# EAGLE schematic navigator (EAGLE 8.2.0)
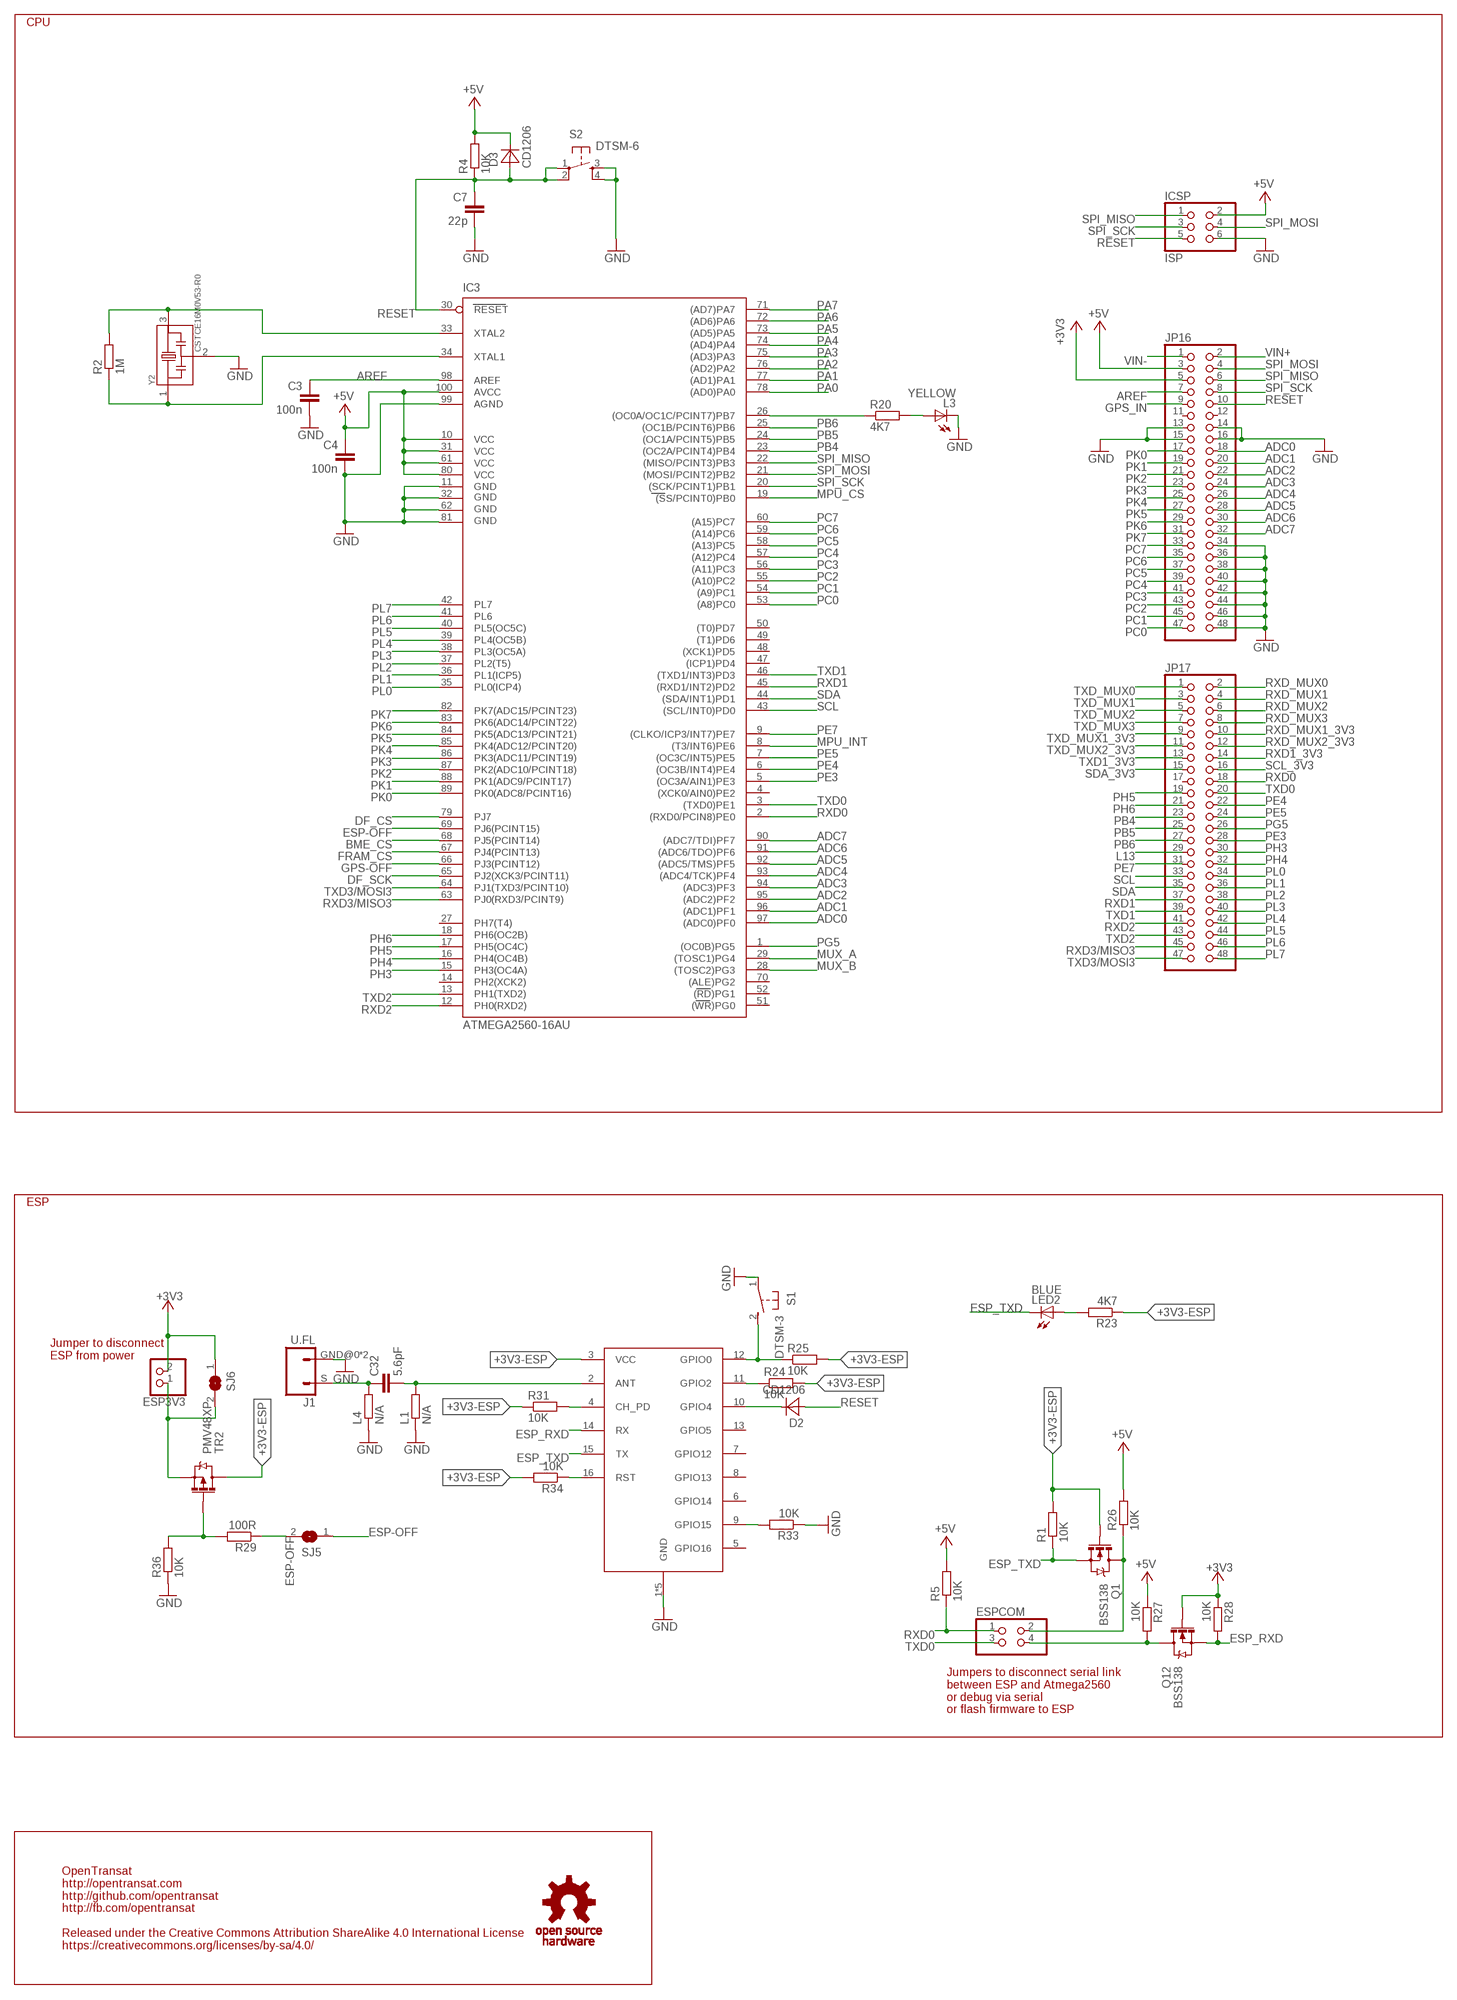
[diagram p0: schematic, sheet 1, part 1 of 2]
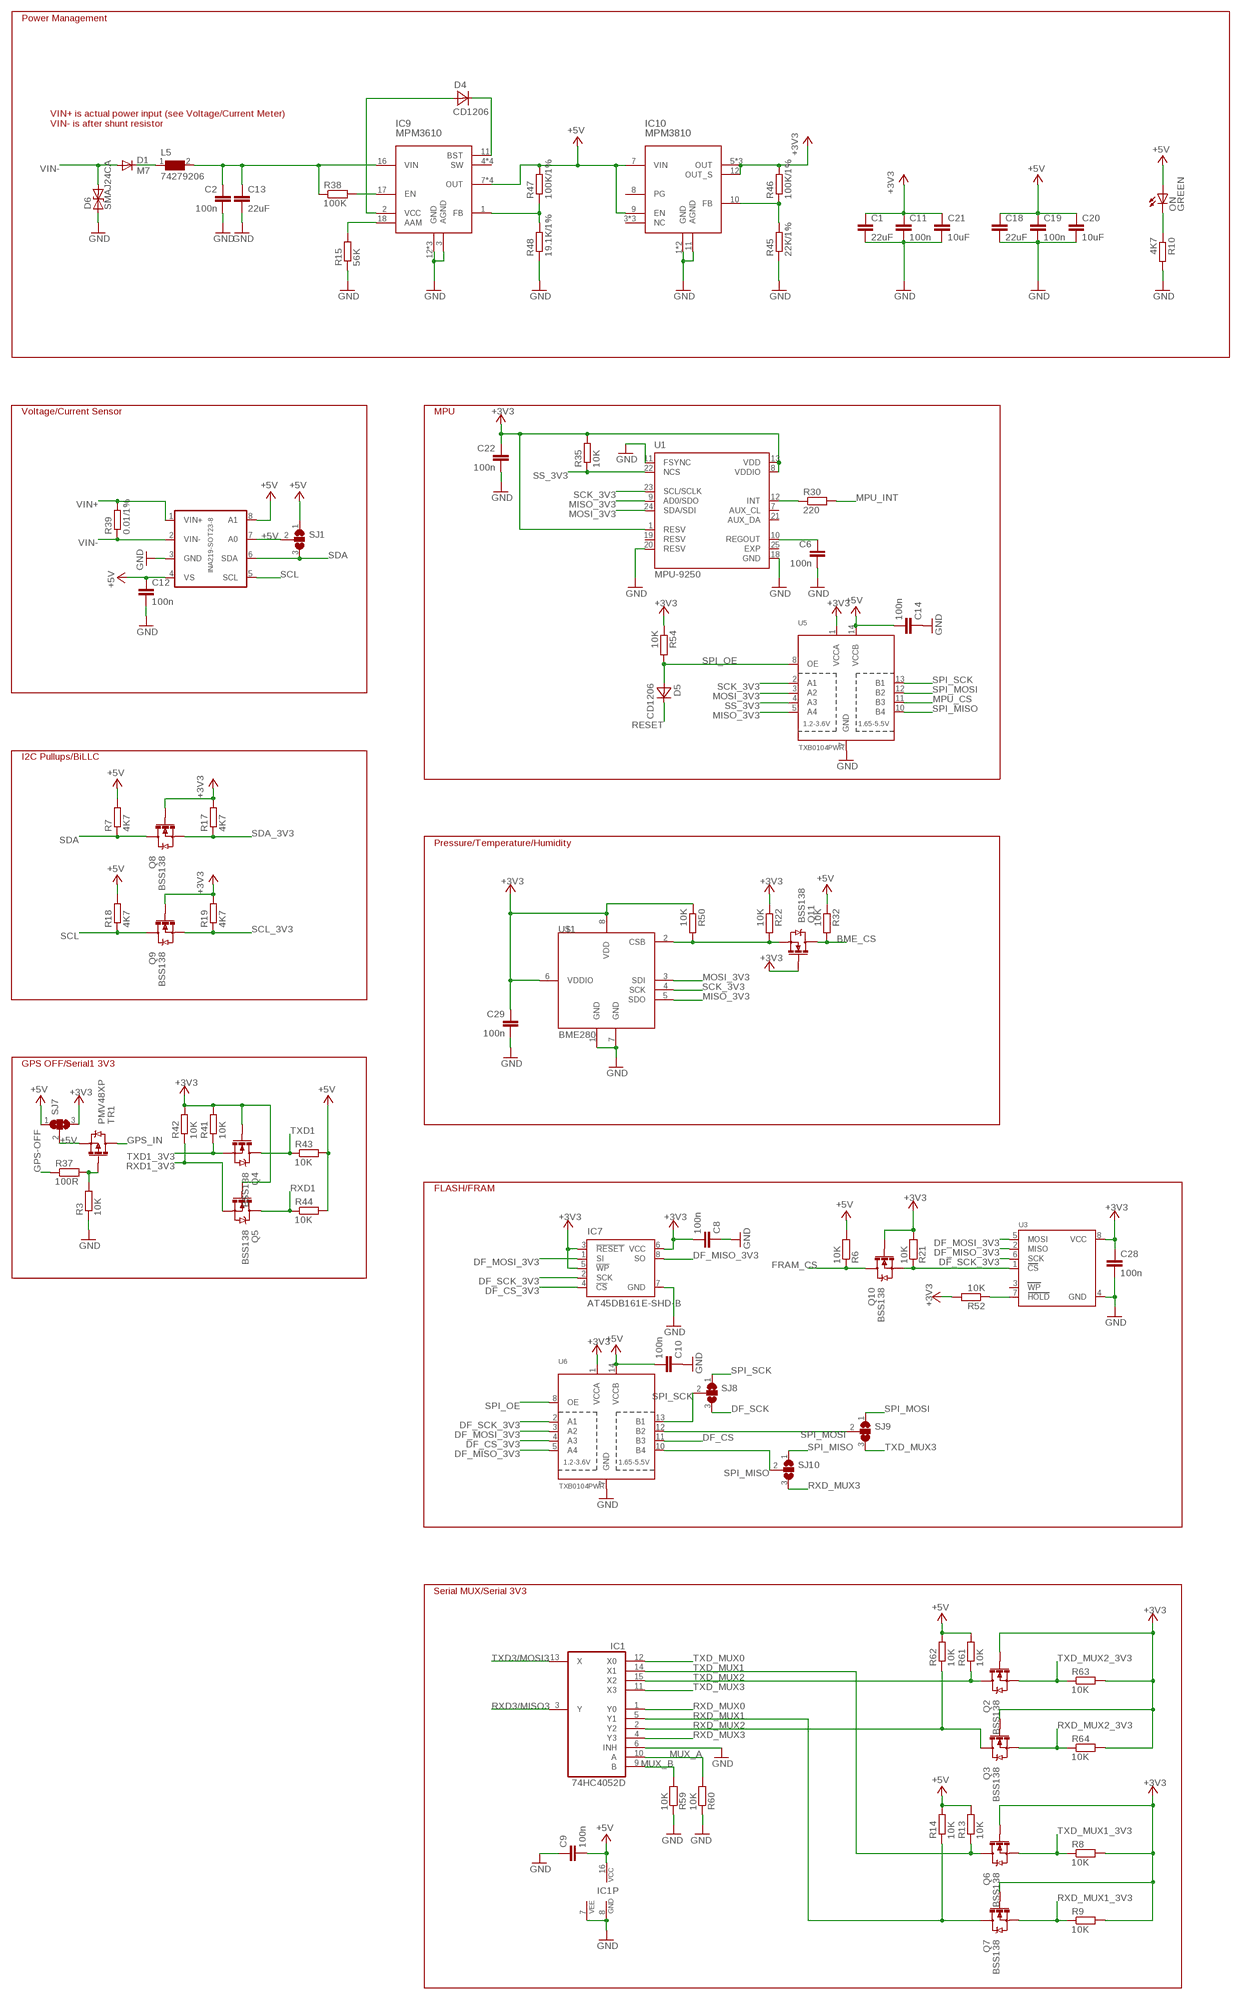
[diagram p1: schematic, sheet 1, part 2 of 2]

## Parts
C1  22uF  C-EUC1210  [C1210]
C2  100n  C-EUC0603  [C0603]
C3  100n  C-EUC0603  [C0603]
C4  100n  C-EUC0603  [C0603]
C6  100n  C-EUC0603  [C0603]
C7  22p  C-EUC0603  [C0603]
C8  100n  C-EUC0603  [C0603]
C9  100n  C-EUC0603  [C0603]
C10  100n  C-EUC0603  [C0603]
C11  100n  C-EUC0603  [C0603]
C12  100n  C-EUC0603  [C0603]
C13  22uF  C-EUC1210  [C1210]
C14  100n  C-EUC0603  [C0603]
C18  22uF  C-EUC1210  [C1210]
C19  100n  C-EUC0603  [C0603]
C20  10uF  C-EUC1206  [C1206]
C21  10uF  C-EUC1206  [C1206]
C22  100n  C-EUC0603  [C0603]
C28  100n  C-EUC0603  [C0603]
C29  100n  C-EUC0603  [C0603]
C32  5.6pF  C-EUC0603  [C0603]
D1  M7  DIODE-DO-214AC  [DO-214AC]
D2  CD1206  [R1206]
D3  CD1206  [R1206]
D4  CD1206  [R1206]
D5  CD1206  [R1206]
D6  SMAJ24CA  [DO214AC]
ESP3V3  PINHD-1X2  [1X02]
ESPCOM  PINHD-2X2  [2X02]
IC1  74HC4052D  4052D  [SO16]
IC3  ATMEGA2560-16AU  [TQFP100]
IC7  AT45DB161E-SHD-B  AT45DB161D-SU  [8S2]
IC9  MPM3610  [MPM_QFN20]
IC10  MPM3810  [MPM_QFN12]
ICSP  ISP  PINHD-2X3  [2X03]
J1  U.FL  CON-HIROSE-COAXIAL-U.FL  [CON-U.FL]
JP16  PINHD-2X24  [2X24]
JP17  PINHD-2X24  [2X24]
L1  N/A  R-EU_R0402  [R0402]
L3  YELLOW  LEDCHIPLED_0805  [CHIPLED_0805]
L4  N/A  R-EU_R0402  [R0402]
L5  74279206  WE-CBF_0805  [0805]
LED2  BLUE  LEDCHIPLED_0805  [CHIPLED_0805]
ON  GREEN  LEDCHIPLED_0805  [CHIPLED_0805]
Q1  BSS138  MOSFET-NCHANNEL_SOT23-3  [SOT23-3]
Q2  BSS138  MOSFET-NCHANNEL_SOT23-3  [SOT23-3]
Q3  BSS138  MOSFET-NCHANNEL_SOT23-3  [SOT23-3]
Q4  BSS138  MOSFET-NCHANNEL_SOT23-3  [SOT23-3]
Q5  BSS138  MOSFET-NCHANNEL_SOT23-3  [SOT23-3]
Q6  BSS138  MOSFET-NCHANNEL_SOT23-3  [SOT23-3]
Q7  BSS138  MOSFET-NCHANNEL_SOT23-3  [SOT23-3]
Q8  BSS138  MOSFET-NCHANNEL_SOT23-3  [SOT23-3]
Q9  BSS138  MOSFET-NCHANNEL_SOT23-3  [SOT23-3]
Q10  BSS138  MOSFET-NCHANNEL_SOT23-3  [SOT23-3]
Q11  BSS138  MOSFET-NCHANNEL_SOT23-3  [SOT23-3]
Q12  BSS138  MOSFET-NCHANNEL_SOT23-3  [SOT23-3]
R1  10K  R-EU_R0603  [R0603]
R2  1M  R-EU_R0603  [R0603]
R3  10K  R-EU_R0603  [R0603]
R4  10K  R-EU_R0603  [R0603]
R5  10K  R-EU_R0603  [R0603]
R6  10K  R-EU_R0603  [R0603]
R7  4K7  R-EU_R0603  [R0603]
R8  10K  R-EU_R0603  [R0603]
R9  10K  R-EU_R0603  [R0603]
R10  4K7  R-EU_R0603  [R0603]
R13  10K  R-EU_R0603  [R0603]
R14  10K  R-EU_R0603  [R0603]
R15  56K  R-EU_R0603  [R0603]
R17  4K7  R-EU_R0603  [R0603]
R18  4K7  R-EU_R0603  [R0603]
R19  4K7  R-EU_R0603  [R0603]
R20  4K7  R-EU_R0603  [R0603]
R21  10K  R-EU_R0603  [R0603]
R22  10K  R-EU_R0603  [R0603]
R23  4K7  R-EU_R0603  [R0603]
R24  10K  R-EU_R0603  [R0603]
R25  10K  R-EU_R0603  [R0603]
R26  10K  R-EU_R0603  [R0603]
R27  10K  R-EU_R0603  [R0603]
R28  10K  R-EU_R0603  [R0603]
R29  100R  R-EU_R0603  [R0603]
R30  220  R-EU_R0603  [R0603]
R31  10K  R-EU_R0603  [R0603]
R32  10K  R-EU_R0603  [R0603]
R33  10K  R-EU_R0603  [R0603]
R34  10K  R-EU_R0603  [R0603]
R35  10K  R-EU_R0603  [R0603]
R36  10K  R-EU_R0603  [R0603]
R37  100R  R-EU_R0603  [R0603]
R38  100K  R-EU_R0603  [R0603]
R39  0.01/1%  R-EU_R2512  [R2512]
R41  10K  R-EU_R0603  [R0603]
R42  10K  R-EU_R0603  [R0603]
R43  10K  R-EU_R0603  [R0603]
R44  10K  R-EU_R0603  [R0603]
R45  22K/1%  R-EU_R0603  [R0603]
R46  100K/1%  R-EU_R0603  [R0603]
R47  100K/1%  R-EU_R0603  [R0603]
R48  19.1K/1%  R-EU_R0603  [R0603]
R50  10K  R-EU_R0603  [R0603]
R52  10K  R-EU_R0603  [R0603]
R54  10K  R-EU_R0603  [R0603]
R59  10K  R-EU_R0603  [R0603]
R60  10K  R-EU_R0603  [R0603]
R61  10K  R-EU_R0603  [R0603]
R62  10K  R-EU_R0603  [R0603]
R63  10K  R-EU_R0603  [R0603]
R64  10K  R-EU_R0603  [R0603]
S1  DTSM-3  [DTSM-3]
S2  DTSM-6  [DTSM-6]
SJ1  SJ2W  [SJ_2]
SJ5  SJ  [SJ]
SJ6  SJ  [SJ]
SJ7  SJ2W  [SJ_2]
SJ8  SJ2W  [SJ_2]
SJ9  SJ2W  [SJ_2]
SJ10  SJ2W  [SJ_2]
TR1  PMV48XP  MOSFET-PCHANNEL_SOT23-3  [SOT23-3]
TR2  PMV48XP  MOSFET-PCHANNEL_SOT23-3  [SOT23-3]
U1  MPU-9250  [QFN40P300X300X105-25N]
U3  FRAM_SOIC8_200MIL_SPI  [SOIC8_200MIL]
U5  TXB0104PWR  [TSSOP14]
U6  TXB0104PWR  [TSSOP14]
U$1  BME280  BME280BME280-LGA  [BME280]
U$2  ESP-06  [ESP-06]
U$3  INA219-SOT23-8  [SOT23-8]
U$4  OSHW  [OSHWM]
Y2  CSTCE16M0V53-R0  [OSC_CSTCE16M0V53-R0]

## Nets
+3V3 [power 3.3V]: C1.1 C8.2 C11.1 C21.1 C22.1 C28.1 C29.1 ESP3V3.2 IC7.3(!RESET) IC7.5(!WP) IC7.6(VCC) IC10.5(OUT) IC10.6(OUT) IC10.12(OUT_S) IC10.14(OUT) JP16.5 Q2.1(G) Q3.1(G) Q4.1(G) Q5.1(G) Q6.1(G) Q7.1(G) Q8.1(G) Q9.1(G) Q10.1(G) Q11.1(G) Q12.1(G) R8.2 R9.2 R17.2 R19.2 R21.2 R22.1 R28.1 R35.2 R41.2 R42.2 R46.2 R50.1 R52.2 R54.1 R63.2 R64.2 SJ6.1 SJ7.3 U1.1(RESV) U1.8(VDDIO) U1.13(VDD) U3.8(VCC) U5.1(VCCA) U6.1(VCCA) U$1.6(VDDIO) U$1.8(VDD)
+3V3-ESP: Q1.1(G) R1.2 R23.1 R24.2 R25.2 R31.1 R34.2 TR2.3(D) U$2.3(VCC)
+5V [power 5V]: C4.1 C9.2 C10.2 C12.1 C14.2 C18.1 C19.1 C20.1 D3.2(C) IC1.16(VCC) IC3.10(VCC) IC3.31(VCC1) IC3.61(VCC2) IC3.80(VCC3) IC3.100(AVCC) IC9.7(OUT) IC9.8(OUT) IC9.9(OUT) IC9.20(OUT) IC10.7(VIN) IC10.9(EN) ICSP.2 JP16.3 ON.A R4.2 R5.2 R6.2 R7.2 R13.2 R14.2 R18.2 R26.2 R27.1 R32.1 R43.2 R44.2 R47.2 R61.2 R62.2 SJ1.1 SJ1.2 SJ7.1 SJ7.2 TR1.2(S) U5.14(VCCB) U6.14(VCCB) U$3.4(VS) U$3.7(A0) U$3.8(A1)
ADC0: IC3.97((ADC0)PF0) JP16.18
ADC1: IC3.96((ADC1)PF1) JP16.20
ADC2: IC3.95((ADC2)PF2) JP16.22
ADC3: IC3.94((ADC3)PF3) JP16.24
ADC4: IC3.93((ADC4/TCK)PF4) JP16.26
ADC5: IC3.92((ADC5/TMS)PF5) JP16.28
ADC6: IC3.91((ADC6/TDO)PF6) JP16.30
ADC7: IC3.90((ADC7/TDI)PF7) JP16.32
AREF: C3.1 IC3.98(AREF) JP16.7
BME_CS: IC3.68(PJ5(PCINT14)) Q11.3(D) R32.2
DF_CS: IC3.79(PJ7) U6.11(B3)
DF_CS_3V3: IC7.4(!CS) U6.4(A3)
DF_MISO_3V3: IC7.8(SO) U3.2(MISO) U6.5(A4)
DF_MOSI_3V3: IC7.1(SI) U3.5(MOSI) U6.3(A2)
DF_SCK: IC3.65(PJ2(XCK3/PCINT11)) SJ8.3
DF_SCK_3V3: IC7.2(SCK) U3.6(SCK) U6.2(A1)
ESP-OFF: IC3.69(PJ6(PCINT15)) R29.1 SJ5.1 SJ5.2
ESP_RXD: Q12.2(S) R28.2 U$2.14(RX)
ESP_TXD: LED2.C Q1.2(S) R1.1 U$2.15(TX)
FRAM_CS: IC3.67(PJ4(PCINT13)) Q10.3(D) R6.1
GND [GND]: C1.2 C2.2 C3.2 C4.2 C6.2 C7.2 C8.1 C9.1 C10.1 C11.2 C12.2 C13.2 C14.1 C18.2 C19.2 C20.2 C21.2 C22.2 C28.2 C29.2 D6.A IC1.6(INH) IC1.7(VEE) IC1.8(GND) IC3.11(GND) IC3.32(GND1) IC3.62(GND2) IC3.81(GND3) IC3.99(AGND) IC7.7(GND) IC9.3(AGND) IC9.12(GND) IC9.13(GND) IC9.14(GND) IC10.1(GND) IC10.2(GND) IC10.11(AGND) ICSP.6 J1.GND@0 J1.GND@1 JP16.13 JP16.14 JP16.15 JP16.16 JP16.34 JP16.36 JP16.38 JP16.40 JP16.42 JP16.44 JP16.46 JP16.48 L1.1 L3.C L4.1 R3.1 R10.2 R15.1 R33.1 R36.1 R45.1 R48.1 R59.1 R60.1 S1.1 S2.3 S2.4 U1.11(FSYNC) U1.18(GND) U1.20(RESV) U3.4(GND) U5.7(GND) U6.7(GND) U$1.1(GND) U$1.7(GND) U$2.1(GND) U$2.17(GND) U$2.18(GND) U$2.19(GND) U$2.20(GND) U$3.3(GND) Y2.2
GPS-OFF: IC3.66(PJ3(PCINT12)) R37.1
GPS_IN: JP16.9 TR1.3(D)
L13: IC3.26((OC0A/OC1C/PCINT7)PB7) JP17.29 R20.1
MISO_3V3: U1.9(AD0/SDO) U5.5(A4) U$1.5(SDO)
MOSI_3V3: U1.24(SDA/SDI) U5.3(A2) U$1.3(SDI)
MPU_CS: IC3.19((SS/PCINT0)PB0) U5.11(B3)
MPU_INT: IC3.8((T3/INT6)PE6) R30.2
MUX_A: IC1.10(A) IC3.29((TOSC1)PG4) R60.2
MUX_B: IC1.9(B) IC3.28((TOSC2)PG3) R59.2
N$1: ESP3V3.1 SJ6.2 TR2.2(S)
N$2: R52.1 U3.7(HOLD)
N$3: ON.C R10.1
N$4: L3.A R20.2
N$5 [power 5V]: D4.1(A) IC9.2(VCC)
N$6: D4.2(C) IC9.11(BST)
N$7: LED2.A R23.2
N$8: R31.2 U$2.4(CH_PD)
N$9: R24.1 U$2.11(GPIO2)
N$10: D2.2(C) U$2.10(GPIO4)
N$11: R33.2 U$2.9(GPIO15)
N$12: C32.1 J1.S L4.2
N$13: R25.1 S1.2 U$2.12(GPIO0)
N$14: R34.1 U$2.16(RST)
N$15: C32.2 L1.2 U$2.2(ANT)
N$16: Q10.2(S) R21.1 U3.1(CS)
N$19: IC10.10(FB) R45.2 R46.1
N$20: ESPCOM.2 Q1.3(D) R26.1
N$21: ESPCOM.4 Q12.3(D) R27.2
N$24: R3.2 R37.2 TR1.1(G)
N$25: R29.2 R36.2 TR2.1(G)
N$26: IC9.1(FB) R47.1 R48.2
N$28: IC9.17(EN) R38.2
N$29: IC9.18(AAM) R15.2
N$31: Q11.2(S) R22.2 R50.2 U$1.2(CSB)
N$35: R30.1 U1.12(INT)
PA0: IC3.78((AD0)PA0)
PA1: IC3.77((AD1)PA1)
PA2: IC3.76((AD2)PA2)
PA3: IC3.75((AD3)PA3)
PA4: IC3.74((AD4)PA4)
PA5: IC3.73((AD5)PA5)
PA6: IC3.72((AD6)PA6)
PA7: IC3.71((AD7)PA7)
PB4: IC3.23((OC2A/PCINT4)PB4) JP17.23
PB5: IC3.24((OC1A/PCINT5)PB5) JP17.25
PB6: IC3.25((OC1B/PCINT6)PB6) JP17.27
PC0: IC3.53((A8)PC0) JP16.47
PC1: IC3.54((A9)PC1) JP16.45
PC2: IC3.55((A10)PC2) JP16.43
PC3: IC3.56((A11)PC3) JP16.41
PC4: IC3.57((A12)PC4) JP16.39
PC5: IC3.58((A13)PC5) JP16.37
PC6: IC3.59((A14)PC6) JP16.35
PC7: IC3.60((A15)PC7) JP16.33
PE3: IC3.5((OC3A/AIN1)PE3) JP17.28
PE4: IC3.6((OC3B/INT4)PE4) JP17.22
PE5: IC3.7((OC3C/INT5)PE5) JP17.24
PE7: IC3.9((CLKO/ICP3/INT7)PE7) JP17.31
PG5: IC3.1((OC0B)PG5) JP17.26
PH3: IC3.15(PH3(OC4A)) JP17.30
PH4: IC3.16(PH4(OC4B)) JP17.32
PH5: IC3.17(PH5(OC4C)) JP17.19
PH6: IC3.18(PH6(OC2B)) JP17.21
PK0: IC3.89(PK0(ADC8/PCINT16)) JP16.17
PK1: IC3.88(PK1(ADC9/PCINT17)) JP16.19
PK2: IC3.87(PK2(ADC10/PCINT18)) JP16.21
PK3: IC3.86(PK3(ADC11/PCINT19)) JP16.23
PK4: IC3.85(PK4(ADC12/PCINT20)) JP16.25
PK5: IC3.84(PK5(ADC13/PCINT21)) JP16.27
PK6: IC3.83(PK6(ADC14/PCINT22)) JP16.29
PK7: IC3.82(PK7(ADC15/PCINT23)) JP16.31
PL0: IC3.35(PL0(ICP4)) JP17.34
PL1: IC3.36(PL1(ICP5)) JP17.36
PL2: IC3.37(PL2(T5)) JP17.38
PL3: IC3.38(PL3(OC5A)) JP17.40
PL4: IC3.39(PL4(OC5B)) JP17.42
PL5: IC3.40(PL5(OC5C)) JP17.44
PL6: IC3.41(PL6) JP17.46
PL7: IC3.42(PL7) JP17.48
PWRIN2 [power 5V]: D1.C L5.1
REGOUT: C6.1 U1.10(REGOUT)
RESET: C7.1 D2.1(A) D3.1(A) D5.2(C) IC3.30(RESET) ICSP.5 JP16.10 R4.1 S2.1 S2.2
RXD0: ESPCOM.1 IC3.2((RXD0/PCIN8)PE0) JP17.18 R5.1
RXD1: IC3.45((RXD1/INT2)PD2) JP17.37 Q5.3(D) R44.1
RXD1_3V3: JP17.14 Q5.2(S) R42.1
RXD2: IC3.12(PH0(RXD2)) JP17.41
RXD3/MISO3: IC1.3(Y) IC3.63(PJ0(RXD3/PCINT9)) JP17.45
RXD_MUX0: IC1.1(Y0) JP17.2
RXD_MUX1: IC1.5(Y1) JP17.4 Q7.3(D) R14.1
RXD_MUX1_3V3: JP17.10 Q7.2(S) R9.1
RXD_MUX2: IC1.2(Y2) JP17.6 Q3.3(D) R62.1
RXD_MUX2_3V3: JP17.12 Q3.2(S) R64.1
RXD_MUX3: IC1.4(Y3) JP17.8 SJ10.3
SCK_3V3: U1.23(SCL/SCLK) U5.2(A1) U$1.4(SCK)
SCL: IC3.43((SCL/INT0)PD0) JP17.33 Q9.3(D) R18.1 U$3.5(SCL)
SCL_3V3: JP17.16 Q9.2(S) R19.1
SDA: IC3.44((SDA/INT1)PD1) JP17.35 Q8.3(D) R7.1 SJ1.3 U$3.6(SDA)
SDA_3V3: JP17.15 Q8.2(S) R17.1
SPI_MISO: IC3.22((MISO/PCINT3)PB3) ICSP.1 JP16.6 SJ10.1 SJ10.2 U5.10(B4) U6.10(B4)
SPI_MOSI: IC3.21((MOSI/PCINT2)PB2) ICSP.4 JP16.4 SJ9.1 SJ9.2 U5.12(B2) U6.12(B2)
SPI_OE: D5.1(A) R54.2 U5.8(OE) U6.8(OE)
SPI_SCK: IC3.20((SCK/PCINT1)PB1) ICSP.3 JP16.8 SJ8.1 SJ8.2 U5.13(B1) U6.13(B1)
SS_3V3: R35.1 U1.22(NCS) U5.4(A3)
TXD0: ESPCOM.3 IC3.3((TXD0)PE1) JP17.20
TXD1: IC3.46((TXD1/INT3)PD3) JP17.39 Q4.3(D) R43.1
TXD1_3V3: JP17.13 Q4.2(S) R41.1
TXD2: IC3.13(PH1(TXD2)) JP17.43
TXD3/MOSI3: IC1.13(X) IC3.64(PJ1(TXD3/PCINT10)) JP17.47
TXD_MUX0: IC1.12(X0) JP17.1
TXD_MUX1: IC1.14(X1) JP17.3 Q6.3(D) R13.1
TXD_MUX1_3V3: JP17.9 Q6.2(S) R8.1
TXD_MUX2: IC1.15(X2) JP17.5 Q2.3(D) R61.1
TXD_MUX2_3V3: JP17.11 Q2.2(S) R63.1
TXD_MUX3: IC1.11(X3) JP17.7 SJ9.3
VIN [power 5V]: C2.1 C13.1 IC9.16(VIN) L5.2 R38.1
VIN+ [power 5V]: JP16.2 R39.2 U$3.1(VIN+)
VIN- [power 5V]: D1.A D6.C JP16.1 R39.1 U$3.2(VIN-)
XTAL1: IC3.34(XTAL1) R2.1 Y2.1
XTAL2: IC3.33(XTAL2) R2.2 Y2.3
Unconnected: IC3.4((XCK0/AIN0)PE2) IC3.14(PH2(XCK2)) IC3.27(PH7(T4)) IC3.47((ICP1)PD4) IC3.48((XCK1)PD5) IC3.49((T1)PD6) IC3.50((T0)PD7) IC3.51((WR)PG0) IC3.52((RD)PG1) IC3.70((ALE)PG2) IC9.4(SW) IC9.5(SW) IC9.6(SW) IC9.19(SW) IC10.3(NC) IC10.4(NC) IC10.8(PG) IC10.13(NC) JP16.11 JP16.12 JP17.17 U1.7(AUX_CL) U1.21(AUX_DA) U3.3(WP) U$2.5(GPIO16) U$2.6(GPIO14) U$2.7(GPIO12) U$2.8(GPIO13) U$2.13(GPIO5)

## Notes on the sheet
- CPU | Power Management
- VIN+ is actual power input (see Voltage/Current Meter)
  VIN- is after shunt resistor
- Voltage/Current Sensor | MPU
- I2C Pullups/BiLLC
- Pressure/Temperature/Humidity
- ESP
- GPS OFF/Serial1 3V3
- Jumper to disconnect
  ESP from power
- FLASH/FRAM
- Jumpers to disconnect serial link
  between ESP and Atmega2560
  or debug via serial
  or flash firmware to ESP
- OpenTransat
  http://opentransat.com
  http://github.com/opentransat
  http://fb.com/opentransat
  
  Released under the Creative Commons Attribution ShareAlike 4.0 International License
  https://creativecommons.org/licenses/by-sa/4.0/
- Serial MUX/Serial 3V3

## Power pins joined to a net without a drawn wire
EXP: U1.25(EXP)
RESV: U1.19(RESV)

## Library data of the parts
C1-C4 C6-C14 C18-C22 C28 C29 C32 = rcl:C-EU: CAPACITOR, European symbol
D1 = diode:DIODE-: DIODE
D2-D5 = diodes_smd:CD1206
D6 = smaj_10:SMAJ*CA: SMAJ Series TVS Diodes Source: http://www.littelfuse.com/~/media/electronics/datasheets/tvs_diodes/littelfuse_tvs_diode_smaj_datasheet.pdf.pdf; MF: Littelfuse; MPN: SMAJ24CA; OC_FARNELL: 1677579; OC_NEWARK: 71J1995
ESP3V3 = pinhead:PINHD-1X2: PIN HEADER
ESPCOM = pinhead:PINHD-2X2: PIN HEADER
IC1 = 40xx_spads:4052: Dual 4-channel ANALOG MULTIPLEXER
IC3 = atmel-2005:ATMEGA*: MICROCONTROLLER 64/128/256 Kbytes FLASH 4 Kbytes EEPROM 8 Kbytes SRAM 86 General Purpose I/O pins 12-channels16-bit PWM 4 x Serial USARTs 16-channels 10-bit A/D
IC7 = atmel:AT45DB161D: 16-megabit 2.5V or 2.7V DataFlash Source: http://www.atmel.com/dyn/resources/prod_documents/doc3500.pdf; MF: ATMEL; MPN: AT45DB161D-SU; OC_FARNELL: 1455040
IC9 = Buck_Converters:MPM3610; MOUSER: http://www.mouser.sk/search/ProductDetail.aspx?R=0virtualkey0virtualkeyMPM3610GQV-P
IC10 = Buck_Converters:MPM3810; MOUSER: http://www.mouser.sk/search/ProductDetail.aspx?R=0virtualkey0virtualkeyMPM3810GQB-33-P
ICSP = pinhead:PINHD-2X3: PIN HEADER
J1 = m-pad-2.1:CON-HIROSE-COAXIAL: Hirose SMT 50 ohm impedance connector W.FL ............................. 1.4mm mated height, ultra small SMT connectors .................................. DC to 3GHz U.FL .............................. 1.9mm or 2.4mm mated height, ultra small SMT connectors ................... DC to 6GHz E.FL ............................... 3.2mm mated height, ultra small SMT connectors .................................. DC to 2GHz H.FL .............................. 3.0mm mated height, ultra small SMT connectors ................................... DC to 3GHz S.FL. ............................. 6.0mm mated height, SMT connectors ................................................... DC to 2.5GHz FL ................................. 10.5mm mated height, SMT connectors .................................................. DC to 1.5GHz Please send any comments to: messi@users.sourceforge.net
JP16 JP17 = pinhead:PINHD-2X24: PIN HEADER
L1 L4 R1-R10 R13-R15 R17-R39 R41-R48 R50 R52 R54 R59-R64 = rcl:R-EU_: RESISTOR, European symbol
L3 LED2 ON = led:LED: LED OSRAM: - CHIPLED LG R971, LG N971, LY N971, LG Q971, LY Q971, LO R971, LY R971 LH N974, LH R974 LS Q976, LO Q976, LY Q976 LO Q996 - Hyper CHIPLED LW Q18S LB Q993, LB Q99A, LB R99A - SideLED LS A670, LO A670, LY A670, LG A670, LP A670 LB A673, LV A673, LT A673, LW A673 LH A674 LY A675 LS A676, LA A676, LO A676, LY A676, LW A676 LS A679, LY A679, LG A679 - Hyper Micro SIDELED® LS Y876, LA Y876, LO Y876, LY Y876 LT Y87S - SmartLED LW L88C, LW L88S LB L89C, LB L89S, LG L890 LS L89K, LO L89K, LY L89K LS L896, LA L896, LO L896, LY L896 - TOPLED LS T670, LO T670, LY T670, LG T670, LP T670 LSG T670, LSP T670, LSY T670, LOP T670, LYG T670 LG T671, LOG T671, LSG T671 LB T673, LV T673, LT T673, LW T673 LH T674 LS T676, LA T676, LO T676, LY T676, LB T676, LH T676, LSB T676, LW T676 LB T67C, LV T67C, LT T67C, LS T67K, LO T67K, LY T67K, LW E67C LS E67B, LA E67B, LO E67B, LY E67B, LB E67C, LV E67C, LT E67C LW T67C LS T679, LY T679, LG T679 LS T770, LO T770, LY T770, LG T770, LP T770 LB T773, LV T773, LT T773, LW T773 LH T774 LS E675, LA E675, LY E675, LS T675 LS T776, LA T776, LO T776, LY T776, LB T776 LHGB T686 LT T68C, LB T68C - Hyper Mini TOPLED® LB M676 - Mini TOPLED Santana® LG M470 LS M47K, LO M47K, LY M47K Source: http://www.osram.convergy.de LUXEON: - LUMILED® LXK2-PW12-R00, LXK2-PW12-S00, LXK2-PW14-U00, LXK2-PW14-V00 LXK2-PM12-R00, LXK2-PM12-S00, LXK2-PM14-U00 LXK2-PE12-Q00, LXK2-PE12-R00, LXK2-PE12-S00, LXK2-PE14-T00, LXK2-PE14-U00 LXK2-PB12-K00, LXK2-PB12-L00, LXK2-PB12-M00, LXK2-PB14-N00, LXK2-PB14-P00, LXK2-PB14-Q00 LXK2-PR12-L00, LXK2-PR12-M00, LXK2-PR14-Q00, LXK2-PR14-R00 LXK2-PD12-Q00, LXK2-PD12-R00, LXK2-PD12-S00 LXK2-PH12-R00, LXK2-PH12-S00 LXK2-PL12-P00, LXK2-PL12-Q00, LXK2-PL12-R00 Source: www.luxeon.com KINGBRIGHT: KA-3528ASYC Source: www.kingbright.com
L5 = Wurth_Elektronik_Passive_rev15b:WE-CBF: SMD EMI Suppression Ferrite Beads WE-CBF - Excellent anti-EMI properties - Low DC-restistance - Impedances till 3000 ohms - Rated current up to 6 A -- Reliable Ni-Sn electrodes -- Perfect as data lined filter and for uncoupling of distribution voltage <http://katalog.we-online.de/media/images/eisos/FeCBF_pf2.jpg> Details see: http://katalog.we-online.de/en/pbs/WE-CBF updated by Dan Xu 2014-06-19 2014 (C) Würth Elektronik
Q1-Q12 = Simplex-DiscreteSemi:MOSFET-NCHANNEL: Generic N-channel mosfet
S1 = switch-tact:DTSM-3
S2 = switch-tact:DTSM-6
SJ1 SJ7-SJ10 = jumper:SJ2W: SMD solder JUMPER
SJ5 SJ6 = jumper:SJ: SMD solder JUMPER
TR1 TR2 = Simplex-DiscreteSemi:MOSFET-PCHANNEL: Generic P-channel mosfet
U1 = MPU-9250:MPU-9250: GYRO/ACCEL/COMPASS/9-AXIS; AVAILABILITY: Good; DESCRIPTION: SMD Gyroscope/Accelerometer/Magnetometer Sensor%3B 9-AXIS; MF: InvenSense; MP: MPU-9250; PACKAGE: QFN-24 InvenSense; PRICE: 6.51 USD
U3 = FRAM:FRAM_SOIC8_200MIL_SPI: SPI FRAM - SOIC8 Package 64KBit (8Kx8) - MB85RS64VPNF-G-JNERE1 - SOIC-8 150 Mil, 3-5.5V, -40°C-85°C, 20MHz
U5 U6 = TXB0104PWR:TXB0104PWR: 4-Bit Bi-Directional Level Shifter 1.2V-3.6V (VCCA) to 1.65V-5.5V (VCCB) bi-directional level shifter with auto direction sensing. Max data rate - VCCA 1.8V: 20Mbps (50ns), VCCA 3.3V: 100Mbps (10ns) Digikey: 296-21929-1-ND (TSSOP) IC-11329; AVAILABILITY: Good; DESCRIPTION: 4-Bit Bidirectional Voltage-Level Translator with Auto Direction Sensing and %2B/-15 kV ESD Protect 14-TSSOP -40 to 85; MF: Texas Instruments; MP: TXB0104PWR; PACKAGE: TSSOP-14 Texas Instruments; PRICE: 24.06 USD
U$1 = BME280:BME280; AVAILABILITY: Good; DESCRIPTION: Integrated pressure%2C humidity and temperature sensor%3B 8-pin 2.5x2.5x0.93mm LGA; MF: Bosch; MP: BME280; PACKAGE: LGA-8 Bosch; PRICE: 5.08 USD
U$2 = ESP:ESP-06: ESP8266 Wifi chip
U$3 = INA219:INA219-SOT23-8: INA219 Bi-Directional CURRENT/POWER MONITOR with I2C™ Interface http://www.ti.com/lit/ds/symlink/ina219.pdf
U$4 = oshw:OSHW
Y2 = CSTCE16M0V53-R0:CSTCE16M0V53-R0: 16MHz Ceramic Resonator Built in Capacitor 15pF ±0.3% -20°C ~ 80°C Surface Mount; AVAILABILITY: Good; DESCRIPTION: Ceramic Resonator 16MHz %3F%3F0.5%25 %28Tol%29 %3F%3F0.3%25 %28Stability%29 15pF 40Ohm 3-Pin CSMD T/R; MF: Murata; MP: CSTCE16M0V53-R0; PACKAGE: SMD-3 Murata; PRICE: 0.30 USD

## Net classes
1 power 5V: width 0.305 mm, drill 0.508 mm, clearance 0.203 mm
2 power 3.3V: width 0.305 mm, drill 0.508 mm, clearance 0.203 mm
3 GND: width 0.305 mm, drill 0.508 mm, clearance 0.203 mm
5 5A: width 1.778 mm, drill 1.168 mm, clearance 0.406 mm